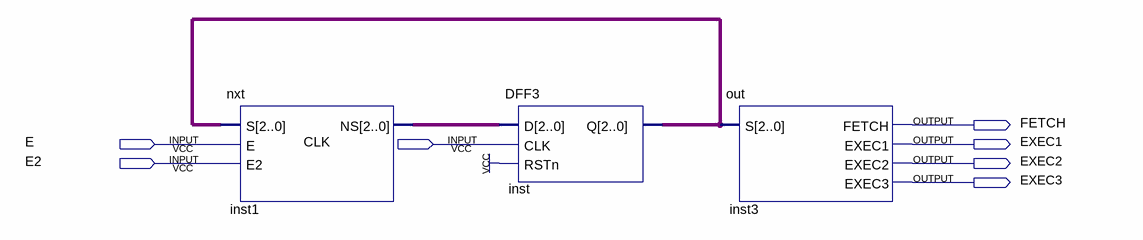
[diagram p0: schematic sheet]
// Quartus schematic StateMachine.bdf as structural Verilog: 3 symbols, 7 pins
module StateMachine (
  input  E,
  input  CLK,
  input  E2,
  output FETCH,
  output EXEC1,
  output EXEC2,
  output EXEC3
);

  wire [2:0] inst1_ns, inst_q;

  nxt inst1 (.S(inst_q), .E(E), .E2(E2), .NS(inst1_ns));
  DFF3 inst (.D(inst1_ns), .CLK(CLK), .RSTn(1'b1), .Q(inst_q));
  out inst3 (.S(inst_q), .FETCH(FETCH), .EXEC1(EXEC1), .EXEC2(EXEC2), .EXEC3(EXEC3));
endmodule
